# Altium schematic sheet Top Level.SchDoc: Top Level
size A4; DrawnBy: Alex Dyer; Revision: A; SheetNumber: 1; SheetTotal: 5
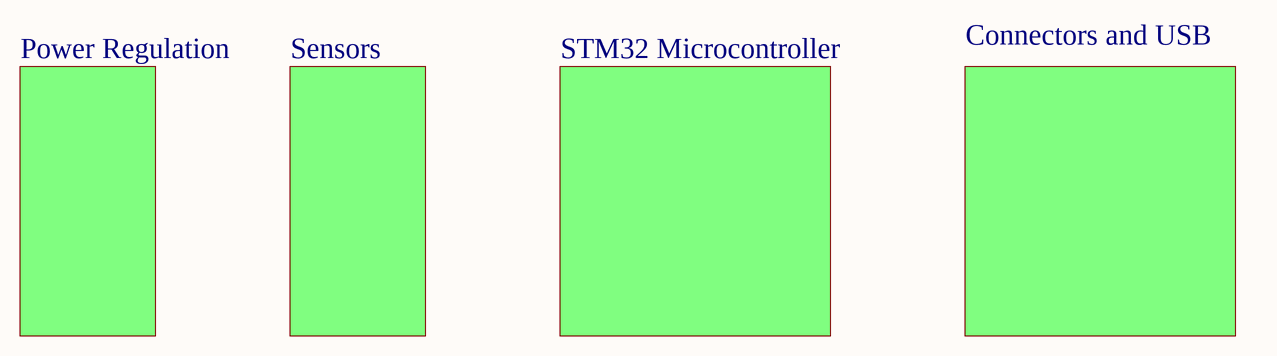
[diagram p0: Top Level.SchDoc]

## Sub-sheets
Connectors and USB = Connectors and USB.SchDoc: no entries
Power Regulation = Power Regulation.SchDoc: no entries
Sensors = Sensors.SchDoc: no entries
STM32 Microcontroller = STM32.SchDoc: no entries

## Notes on the sheet
- Title:
- Size:
- Date:
- A4
- Drawn By:
- Time:
- Sheet
- Revision:
- of